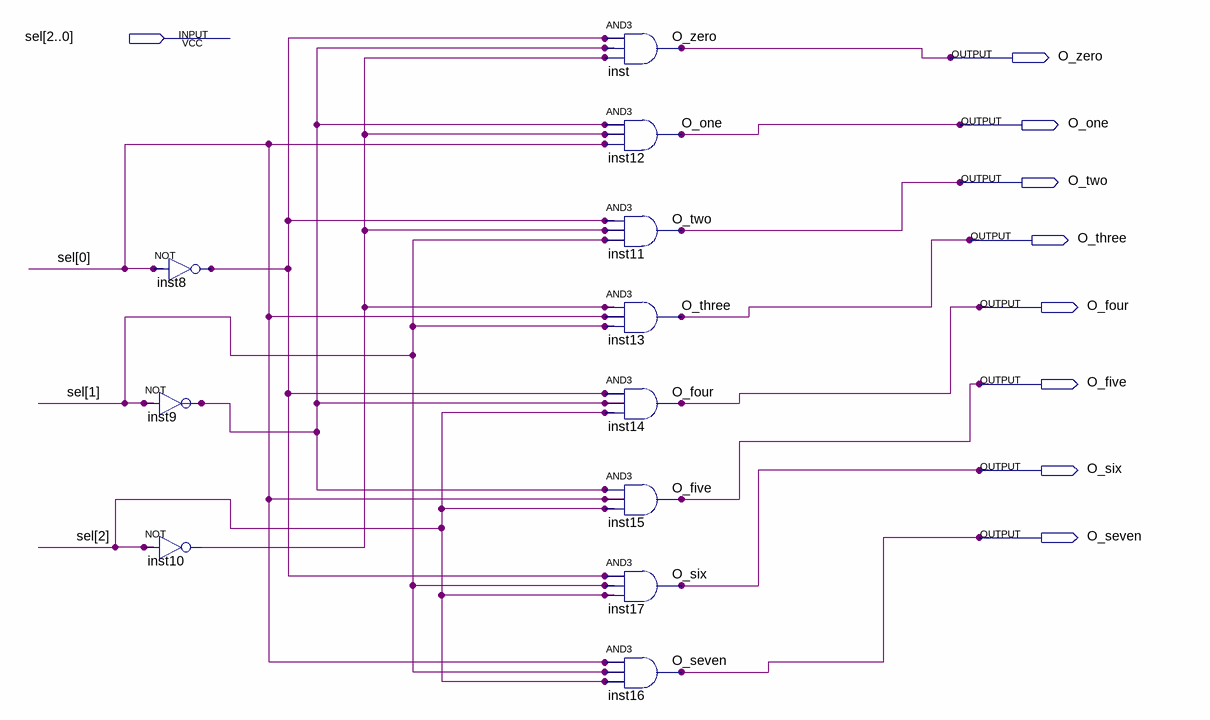
[diagram p0: schematic sheet]
// Quartus schematic decoder.bdf as structural Verilog: 11 symbols, 9 pins
module decoder (
  input  [2:0] sel,
  output O_zero,
  output O_one,
  output O_two,
  output O_three,
  output O_four,
  output O_five,
  output O_six,
  output O_seven
);

  wire inst8_out, inst9_out, inst10_out;

  not inst8 (inst8_out, sel[0]);
  not inst9 (inst9_out, sel[1]);
  not inst10 (inst10_out, sel[2]);
  and inst (O_zero, inst8_out, inst9_out, inst10_out);
  and inst12 (O_one, inst9_out, inst10_out, sel[0]);
  and inst11 (O_two, inst8_out, inst10_out, sel[1]);
  and inst13 (O_three, inst10_out, sel[0], sel[1]);
  and inst14 (O_four, inst8_out, inst9_out, sel[2]);
  and inst15 (O_five, inst9_out, sel[0], sel[2]);
  and inst17 (O_six, inst8_out, sel[1], sel[2]);
  and inst16 (O_seven, sel[0], sel[1], sel[2]);
endmodule
